# Altium schematic sheet S7CAS-PLEIADES-CARTE-MERE_P20_Flash-FPGA-bank-2.SchDoc
size Tabloid; Sheet_Name: Insert name in Document Parameters; Size: 11x17
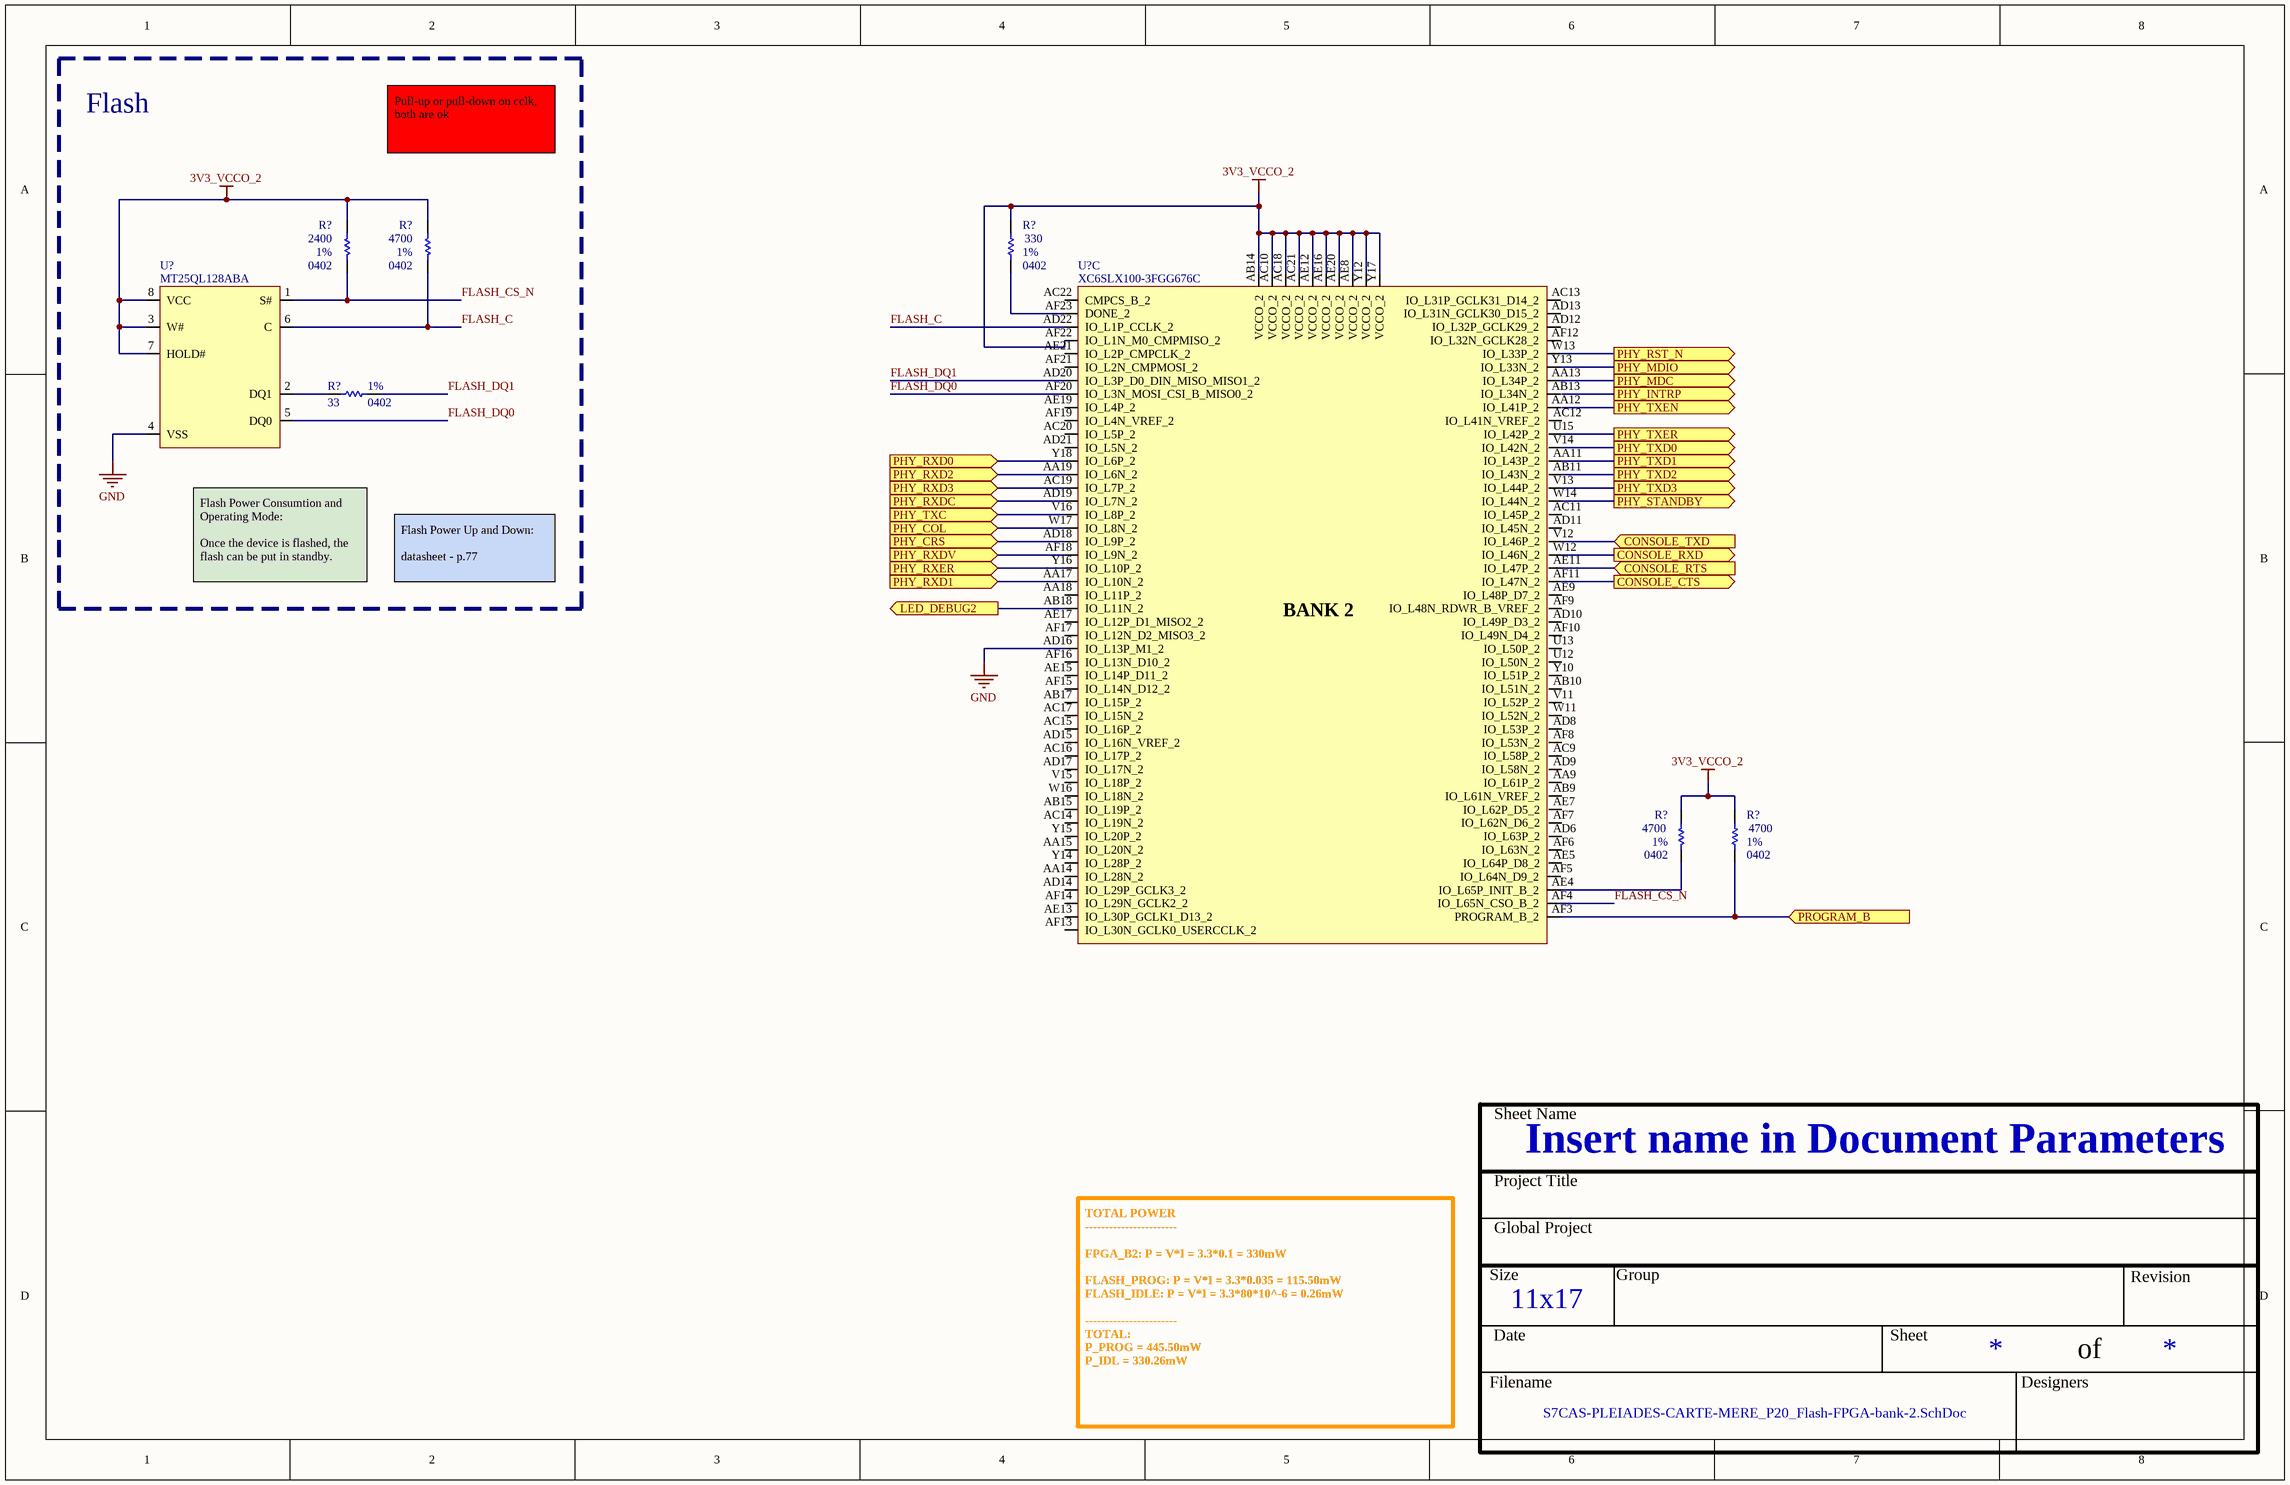
[diagram p0: S7CAS-PLEIADES-CARTE-MERE_P20_Flash-FPGA-bank-2.SchDoc]

## Parts
(Parts that share a designator on the sheet are numbered #1, #2 ... from top to bottom, then left to right.)
R?#1  value 2400  Package: 0402  Precision: 1%  [RES_0402]  (hidden comment: RES - 0402)
R?#2  value 4700  Package: 0402  Precision: 1%  [RES_0402]  (hidden comment: RES - 0402)
R?#3  value 330  Package: 0402  Precision: 1%  [RES_0402]  (hidden comment: RES - 0402)
R?#4  value 33  Package: 0402  Precision: 1%  [RES_0402]  (hidden comment: RES - 0402)
R?#5  value 4700  Package: 0402  Precision: 1%  [RES_0402]  (hidden comment: RES - 0402)
R?#6  value 4700  Package: 0402  Precision: 1%  [RES_0402]  (hidden comment: RES - 0402)
U?#1  MT25QL128ABA
U?#2  XC6SLX100-3FGG676C  [FPGA_XILINX_FGG676]  (part C of 10)

## Blocks framed on the sheet
Flash: R?#1 R?#2 R?#4 U?#1

## Ports
CONSOLE_CTS (out), CONSOLE_RTS (in), CONSOLE_RXD (out), CONSOLE_TXD (in), LED_DEBUG2 (out), PHY_COL (in), PHY_CRS (in), PHY_INTRP (out), PHY_MDC (out), PHY_MDIO (out), PHY_RST_N (out), PHY_RXD0 (in), PHY_RXD1 (in), PHY_RXD2 (in), PHY_RXD3 (in), PHY_RXDC (in), PHY_RXDV (in), PHY_RXER (in), PHY_STANDBY (out), PHY_TXC (in), PHY_TXD0 (out), PHY_TXD1 (out), PHY_TXD2 (out), PHY_TXD3 (out), PHY_TXEN (out), PHY_TXER (out), PROGRAM_B (in)

## Nets
3V3_VCCO_2: R?#1.2 R?#2.2 R?#3.2 R?#5.2 R?#6.2 U?#1.3(W#) U?#1.7(HOLD#) U?#1.8(VCC) U?#2.AB14(VCCO_2) U?#2.AC10(VCCO_2) U?#2.AC18(VCCO_2) U?#2.AC21(VCCO_2) U?#2.AE8(VCCO_2) U?#2.AE12(VCCO_2) U?#2.AE16(VCCO_2) U?#2.AE20(VCCO_2) U?#2.AF22(IO_L1N_M0_CMPMISO_2) U?#2.Y12(VCCO_2) U?#2.Y17(VCCO_2)
GND: U?#1.4(VSS) U?#2.AD16(IO_L13P_M1_2)
CONSOLE_CTS: U?#2.AF11(IO_L47N_2) ; port CONSOLE_CTS
CONSOLE_RTS: U?#2.AE11(IO_L47P_2) ; port CONSOLE_RTS
CONSOLE_RXD: U?#2.W12(IO_L46N_2) ; port CONSOLE_RXD
CONSOLE_TXD: U?#2.V12(IO_L46P_2) ; port CONSOLE_TXD
FLASH_C: R?#2.1 U?#1.6(C) U?#2.AD22(IO_L1P_CCLK_2)
FLASH_CS_N: R?#1.1 U?#1.1(S#) U?#2.AF4(IO_L65N_CSO_B_2)
FLASH_DQ0: U?#1.5(DQ0) U?#2.AF20(IO_L3N_MOSI_CSI_B_MISO0_2)
FLASH_DQ1: R?#4.1 U?#2.AD20(IO_L3P_D0_DIN_MISO_MISO1_2)
LED_DEBUG2: U?#2.AB18(IO_L11N_2) ; port LED_DEBUG2
PHY_COL: U?#2.W17(IO_L8N_2) ; port PHY_COL
PHY_CRS: U?#2.AD18(IO_L9P_2) ; port PHY_CRS
PHY_MDC: U?#2.AA13(IO_L34P_2) ; port PHY_MDC
PHY_MDIO: U?#2.Y13(IO_L33N_2) ; port PHY_MDIO
PHY_RST_N: U?#2.W13(IO_L33P_2) ; port PHY_RST_N
PHY_RXD0: U?#2.Y18(IO_L6P_2) ; port PHY_RXD0
PHY_RXD1: U?#2.AA17(IO_L10N_2) ; port PHY_RXD1
PHY_RXD2: U?#2.AA19(IO_L6N_2) ; port PHY_RXD2
PHY_RXD3: U?#2.AC19(IO_L7P_2) ; port PHY_RXD3
PHY_RXDC: U?#2.AD19(IO_L7N_2) ; port PHY_RXDC
PHY_RXDV: U?#2.AF18(IO_L9N_2) ; port PHY_RXDV
PHY_RXER: U?#2.Y16(IO_L10P_2) ; port PHY_RXER
PHY_STANDBY: U?#2.W14(IO_L44N_2) ; port PHY_STANDBY
PHY_TXC: U?#2.V16(IO_L8P_2) ; port PHY_TXC
PHY_TXD0: U?#2.V14(IO_L42N_2) ; port PHY_TXD0
PHY_TXD1: U?#2.AA11(IO_L43P_2) ; port PHY_TXD1
PHY_TXD2: U?#2.AB11(IO_L43N_2) ; port PHY_TXD2
PHY_TXD3: U?#2.V13(IO_L44P_2) ; port PHY_TXD3
PHY_TXER: U?#2.U15(IO_L42P_2) ; port PHY_TXER
PROGRAM_B: R?#6.1 U?#2.AF3(PROGRAM_B_2) ; port PROGRAM_B
NetR?#3_1: R?#3.1 U?#2.AF23(DONE_2)
NetR?#4_2: R?#4.2 U?#1.2(DQ1)
NetR?#5_1: R?#5.1 U?#2.AE4(IO_L65P_INIT_B_2)

Not connected (* = marked no-connect by the designer): U?#2 AA9(IO_L61P_2) AA12(IO_L41P_2) AA14(IO_L28N_2) AA15(IO_L20N_2) AA18(IO_L11P_2) AB9(IO_L61N_VREF_2) AB10(IO_L51N_2) AB13(IO_L34N_2) AB15(IO_L19P_2) AB17(IO_L15P_2) AC9(IO_L58P_2) AC11(IO_L45P_2) AC12(IO_L41N_VREF_2) AC13(IO_L31P_GCLK31_D14_2) AC14(IO_L19N_2) AC15(IO_L16P_2) AC16(IO_L17P_2) AC17(IO_L15N_2) AC20(IO_L5P_2) AC22(CMPCS_B_2) AD6(IO_L63P_2) AD8(IO_L53P_2) AD9(IO_L58N_2) AD10(IO_L49P_D3_2) AD11(IO_L45N_2) AD12(IO_L32P_GCLK29_2) AD13(IO_L31N_GCLK30_D15_2) AD14(IO_L29P_GCLK3_2) AD15(IO_L16N_VREF_2) AD17(IO_L17N_2) AD21(IO_L5N_2) AE5(IO_L64P_D8_2) AE7(IO_L62P_D5_2) AE9(IO_L48P_D7_2) AE13(IO_L30P_GCLK1_D13_2) AE15(IO_L14P_D11_2) AE17(IO_L12P_D1_MISO2_2) AE19(IO_L4P_2) AE21(IO_L2P_CMPCLK_2) AF5(IO_L64N_D9_2) AF6(IO_L63N_2) AF7(IO_L62N_D6_2) AF8(IO_L53N_2) AF9(IO_L48N_RDWR_B_VREF_2) AF10(IO_L49N_D4_2) AF12(IO_L32N_GCLK28_2) AF13(IO_L30N_GCLK0_USERCCLK_2) AF14(IO_L29N_GCLK2_2) AF15(IO_L14N_D12_2) AF16(IO_L13N_D10_2) AF17(IO_L12N_D2_MISO3_2) AF19(IO_L4N_VREF_2) AF21(IO_L2N_CMPMOSI_2) U12(IO_L50N_2) U13(IO_L50P_2) V11(IO_L52P_2) V15(IO_L18P_2) W11(IO_L52N_2) W16(IO_L18N_2) Y10(IO_L51P_2) Y14(IO_L28P_2) Y15(IO_L20P_2)

## Notes on the sheet
- Pull-up or pull-down on cclk, both are ok
- Flash Power Consumtion and Operating Mode:
  Once the device is flashed, the flash can be put in standby.
- Flash Power Up and Down:
  datasheet - p.77
- TOTAL POWER
  -----------------------
  FPGA_B2: P = V*I = 3.3*0.1 = 330mW
  FLASH_PROG: P = V*I = 3.3*0.035 = 115.50mW
  FLASH_IDLE: P = V*I = 3.3*80*10^-6 = 0.26mW
  -----------------------
  TOTAL:
  P_PROG = 445.50mW
  P_IDL = 330.26mW
- Sheet Name
- Project Title
- Global Project
- Size
- Group
- Revision
- Date
- Sheet
- of
- Filename
- Designers
- (in symbol FPGA_XC6SLX100-3FGG676C, part C) BANK 2

## Library data of the parts
R?#1-R?#3 R?#5 R?#6 = RES - 0402: Voltage: 50V; Power: 1/16W; Current: *; CreatedBy: Jonathan Bouchard
R?#4 = RES - 0402: Mfg Part Number: CRCW040233R0FKEDC; Voltage: 50V; Power: 1/16W; Current: *; CreatedBy: Jonathan Bouchard
U?#1 = FLASH_MT25QL128ABA: MT25QL128ABA - 128Mb, 3V Multiple I/O Serial Flash Memory - Package code : SE; Manufacturer #1: Micron; Voltage Rating: 2V7 - 3V6; GRAMS Lib Spec: 2.7; HelpURL: https://media-www.micron.com/-/media/client/global/documents/products/data-sheet/nor-flash/serial-nor/mt25q/die-rev-a/mt25q_qlhs_l_128_aba_0.pdf; Supplier 1: Digikey; Supplier Part Number 1: MT25QL128ABA1ESE-0SIT TR
U?#2 = FPGA_XC6SLX100-3FGG676C: FPGA - XILINX SPARTAN 6 480 I/O - BGA-676; Voltage: 1.14 V ~ 1.26 V; Current: *; Power: *; Mfg: Xilinx; Mfg Part Number: XC6SLX100-3FGG676C; HelpURL: https://www.xilinx.com/support/documentation/data_sheets/ds162.pdf; CreatedBy: Jonathan Bouchard; Temperature: 0°C ~ 85°C (TJ); Value: *; Precision: *; Package: BGA-676; Supplier 1: Digikey; Supplier Part Number 1: 122-1760-ND